# EAGLE design 4x2_brkout (EAGLE 7.2.0)
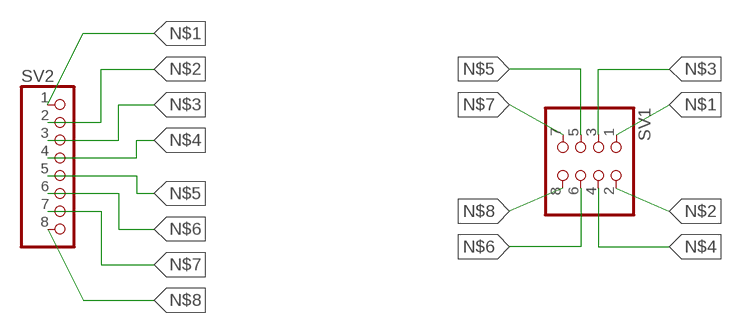
[diagram p0: schematic, sheet 1]

## Parts
SV1  PINHD-2X4  [2X04]
SV2  PINHD-1X8  [1X08]

## Nets
N$1: SV1.1 SV2.1
N$2: SV1.2 SV2.2
N$3: SV1.3 SV2.3
N$4: SV1.4 SV2.4
N$5: SV1.5 SV2.5
N$6: SV1.6 SV2.6
N$7: SV1.7 SV2.7
N$8: SV1.8 SV2.8

## Library data of the parts
SV1 = pinhead:PINHD-2X4: PIN HEADER
SV2 = pinhead:PINHD-1X8: PIN HEADER

## Board
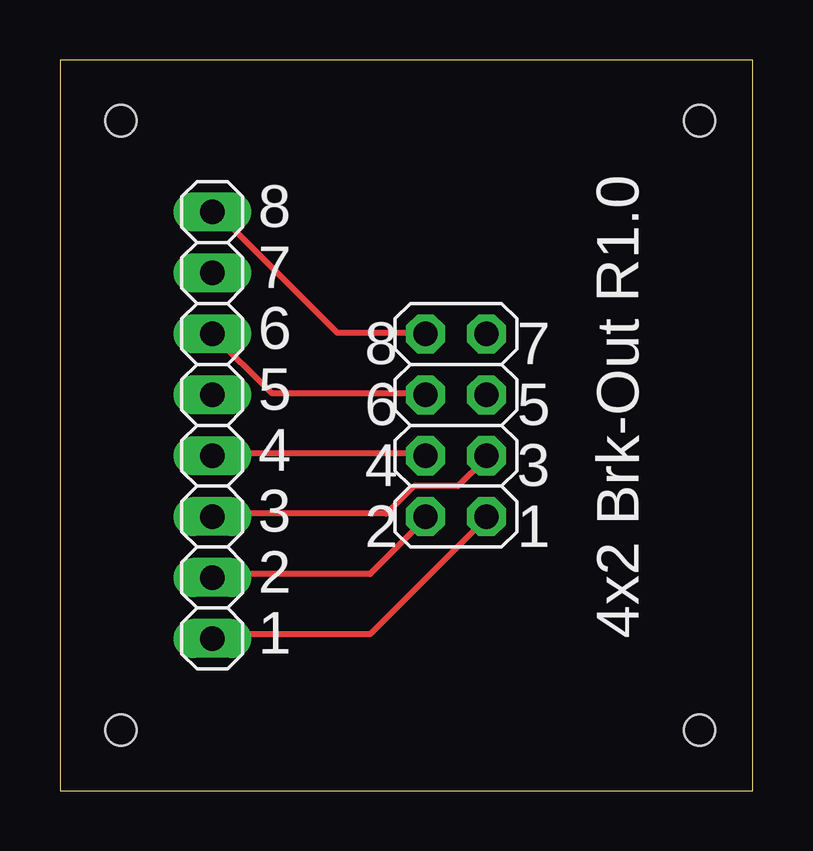
[diagram p1: board, top side]
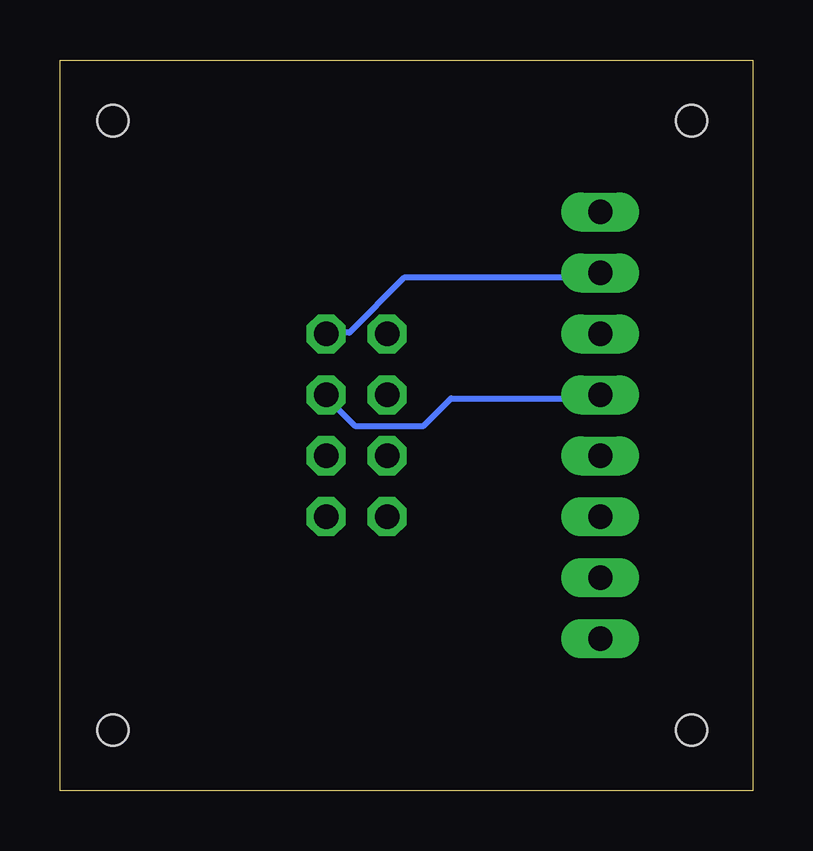
[diagram p2: board, bottom side, seen from below]

Size 28.88 x 30.47 mm. Coordinates in mm from the lower left corner, seen from the top.
Outline: 0,0 28.88,0 28.88,30.47 0,30.47 0,0
Copper layers (1*16): Top 0.035mm / dielectric 1.5mm / Bottom 0.035mm
Design rules "SparkFun": minimum track width 8mil, minimum drill 20mil, track to track 8mil, track to pad 8mil, pad to pad 8mil, via to via 8mil, smd to smd 8mil, copper to edge 10mil, drill to drill 8mil, minimum pad ring 12mil, minimum via ring 10mil, stop-mask expansion 4mil, vias tented up to drill 25mil, thermal gap 10mil
Holes 1.3 mm at 2.54,27.94 26.67,27.94 26.67,2.54 2.54,2.54

### Footprints (pad centres in the part's own frame; a part is rotated, then mirrored left to right if it is on the bottom)
2X04 = drill 1.016 octagon: 1 -3.81,-1.27; 2 -3.81,1.27; 3 -1.27,-1.27; 4 -1.27,1.27; 5 1.27,-1.27; 6 1.27,1.27; 7 3.81,-1.27; 8 3.81,1.27
1X08 = drill 1.016 long: 1 -8.89,0; 2 -6.35,0; 3 -3.81,0; 4 -1.27,0; 5 1.27,0; 6 3.81,0; 7 6.35,0; 8 8.89,0

### Placement (x,y rotation side)
SV1  16.51,15.24 90 top
SV2  6.35,15.24 90 top

### Tracks (layer width: path | path; a pad name or v marks a point on that pad's centre or on a via)
N$1
  Top 0.254: SV2.1 6.53,6.53 12.93,6.53 17.73,11.33 SV1.1
N$2
  Top 0.254: SV2.2 6.53,9.04 12.93,9.04 15.21,11.33 SV1.2
N$3
  Top 0.254: SV2.3 6.53,11.56 13.61,11.56 14.76,12.7 16.59,12.7 17.73,13.84 SV1.3
N$4
  Top 0.254: SV2.4 6.53,14.07 15.21,14.07 SV1.4
N$5
  Bottom 0.254: SV2.5 6.53,16.36 12.57,16.36 13.72,15.21 16.59,15.21 17.73,16.36 SV1.5
N$6
  Top 0.254: SV2.6 8.81,16.59 15.21,16.59 SV1.6
N$7
  Bottom 0.254: SV1.7 17.73,19.1 16.82,19.1 14.53,21.39 6.53,21.39 SV2.7
N$8
  Top 0.254: SV1.8 15.21,19.1 11.56,19.1 6.53,24.13 SV2.8

### Text on the board
tPlace: 8 | 7 | 6 | 8 | 7 | 5 | 6 | 5 | 4 | 4 | 3 | 3 | 2 | 1 | 2 | 1 | 4x2 Brk-Out R1.0